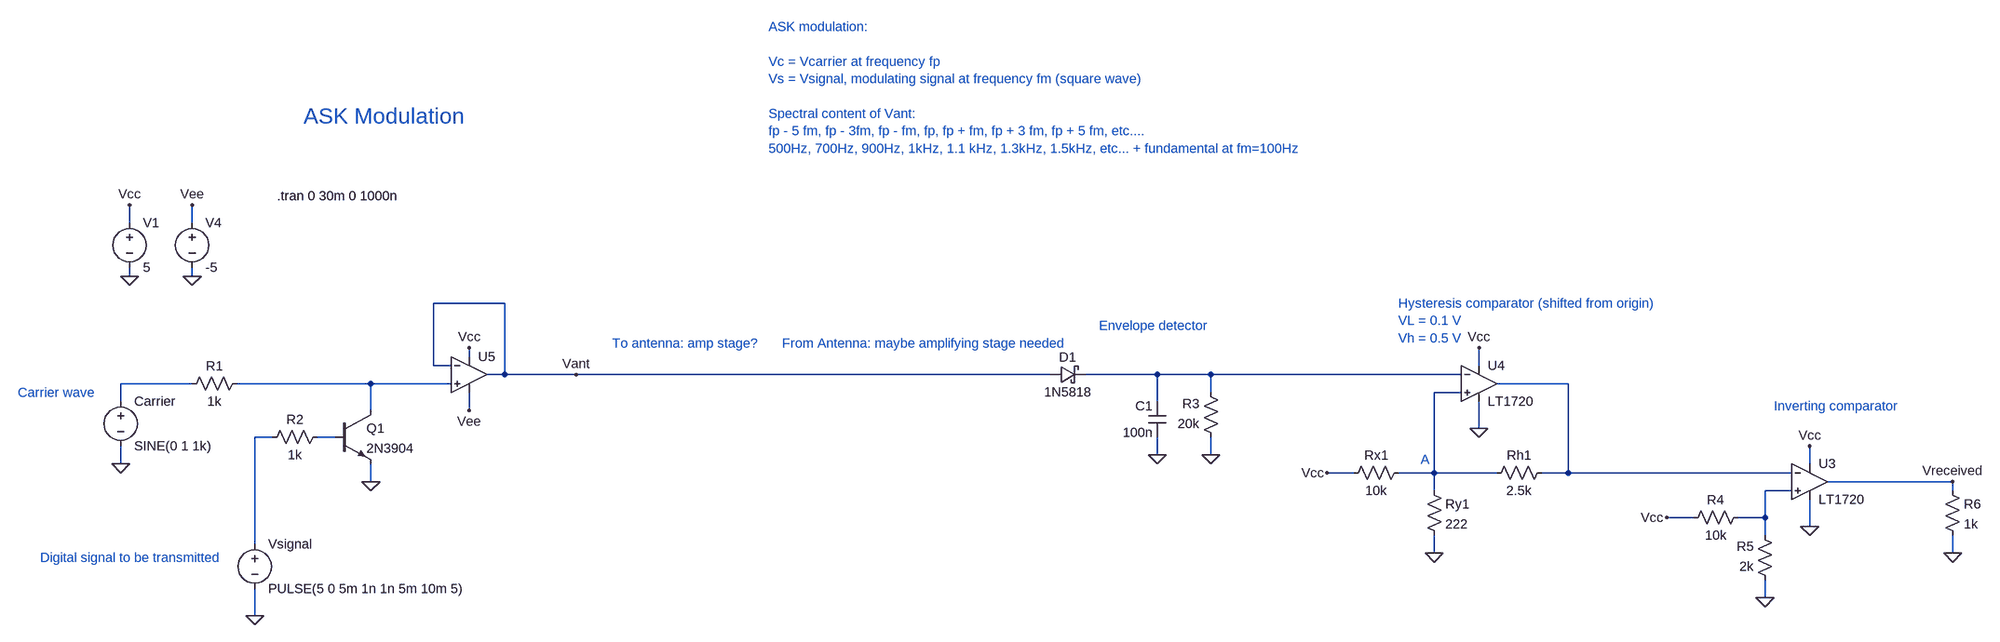
[diagram p0: schematic ASK-modulation.asc]
ASK-modulation.asc, the LTspice schematic file:
Version 4.1
SHEET 1 3624 680
WIRE -656 -80 -656 -112
WIRE -544 -80 -544 -112
WIRE -656 16 -656 0
WIRE -544 16 -544 0
WIRE 16 64 -112 64
WIRE -48 160 -48 144
WIRE -112 176 -112 64
WIRE -80 176 -112 176
WIRE 1760 176 1760 144
WIRE 16 192 16 64
WIRE 16 192 -16 192
WIRE 144 192 16 192
WIRE 992 192 144 192
WIRE 1184 192 1056 192
WIRE 1280 192 1184 192
WIRE 1728 192 1280 192
WIRE -544 208 -672 208
WIRE -224 208 -464 208
WIRE -80 208 -224 208
WIRE 1920 208 1792 208
WIRE 1280 224 1280 192
WIRE 1728 224 1680 224
WIRE -672 240 -672 208
WIRE 1184 240 1184 192
WIRE -224 256 -224 208
WIRE -48 256 -48 224
WIRE 1760 288 1760 240
WIRE -400 304 -432 304
WIRE -288 304 -320 304
WIRE 1184 336 1184 304
WIRE 1280 336 1280 304
WIRE -672 352 -672 320
WIRE 2352 352 2352 320
WIRE 1536 368 1488 368
WIRE 1680 368 1680 224
WIRE 1680 368 1616 368
WIRE 1792 368 1680 368
WIRE 1920 368 1920 208
WIRE 1920 368 1872 368
WIRE 2320 368 1920 368
WIRE -224 384 -224 352
WIRE 2608 384 2384 384
WIRE 1680 400 1680 368
WIRE 2320 400 2272 400
WIRE 2608 400 2608 384
WIRE 2144 448 2096 448
WIRE 2272 448 2272 400
WIRE 2272 448 2224 448
WIRE 2352 464 2352 416
WIRE 2272 480 2272 448
WIRE -432 496 -432 304
WIRE 1680 512 1680 480
WIRE 2608 512 2608 480
WIRE 2272 592 2272 560
WIRE -432 624 -432 576
FLAG -432 624 0
FLAG -672 352 0
FLAG -224 384 0
FLAG -656 16 0
FLAG -656 -112 Vcc
FLAG -544 16 0
FLAG -544 -112 Vee
FLAG 1280 336 0
FLAG 1760 144 Vcc
FLAG 1680 512 0
FLAG 1760 288 0
FLAG 1488 368 Vcc
FLAG 2352 320 Vcc
FLAG 2352 464 0
FLAG 2272 592 0
FLAG 2096 448 Vcc
FLAG 2608 512 0
FLAG -48 144 Vcc
FLAG -48 256 Vee
FLAG 1184 336 0
FLAG 2608 384 Vreceived
FLAG 144 192 Vant
SYMBOL voltage -656 -96 R0
WINDOW 123 0 0 Left 0
WINDOW 39 0 0 Left 0
SYMATTR InstName V1
SYMATTR Value 5
SYMBOL voltage -672 224 R0
WINDOW 123 0 0 Left 0
WINDOW 39 0 0 Left 0
SYMATTR InstName Carrier
SYMATTR Value SINE(0 1 1k)
SYMBOL res -448 192 R90
WINDOW 0 0 56 VBottom 2
WINDOW 3 32 56 VTop 2
SYMATTR InstName R1
SYMATTR Value 1k
SYMBOL npn -288 256 R0
SYMATTR InstName Q1
SYMATTR Value 2N3904
SYMBOL voltage -432 480 R0
WINDOW 123 0 0 Left 0
WINDOW 39 0 0 Left 0
SYMATTR InstName Vsignal
SYMATTR Value PULSE(5 0 5m 1n 1n 5m 10m 5)
SYMBOL voltage -544 -96 R0
WINDOW 123 0 0 Left 0
WINDOW 39 0 0 Left 0
SYMATTR InstName V4
SYMATTR Value -5
SYMBOL res -304 288 R90
WINDOW 0 0 56 VBottom 2
WINDOW 3 32 56 VTop 2
SYMATTR InstName R2
SYMATTR Value 1k
SYMBOL res 1296 320 R180
WINDOW 0 36 76 Left 2
WINDOW 3 36 40 Left 2
SYMATTR InstName R3
SYMATTR Value 20k
SYMBOL cap 1200 304 R180
WINDOW 0 24 56 Left 2
WINDOW 3 24 8 Left 2
SYMATTR InstName C1
SYMATTR Value 100n
SYMBOL res 1632 352 R90
WINDOW 0 0 56 VBottom 2
WINDOW 3 32 56 VTop 2
SYMATTR InstName Rx1
SYMATTR Value 10k
SYMBOL res 1664 384 R0
SYMATTR InstName Ry1
SYMATTR Value 222
SYMBOL res 1888 352 R90
WINDOW 0 0 56 VBottom 2
WINDOW 3 32 56 VTop 2
SYMATTR InstName Rh1
SYMATTR Value 2.5k
SYMBOL Comparators\\LT1720 1760 144 R0
SYMATTR InstName U4
SYMBOL Comparators\\LT1720 2352 320 R0
SYMATTR InstName U3
SYMBOL res 2240 432 R90
WINDOW 0 0 56 VBottom 2
WINDOW 3 32 56 VTop 2
SYMATTR InstName R4
SYMATTR Value 10k
SYMBOL res 2288 576 R180
WINDOW 0 36 76 Left 2
WINDOW 3 36 40 Left 2
SYMATTR InstName R5
SYMATTR Value 2k
SYMBOL res 2592 384 R0
SYMATTR InstName R6
SYMATTR Value 1k
SYMBOL Opamps\\UniversalOpamp2 -48 192 R0
SYMATTR InstName U5
SYMBOL schottky 992 208 R270
WINDOW 0 32 32 VTop 2
WINDOW 3 0 32 VBottom 2
SYMATTR InstName D1
SYMATTR Value 1N5818
SYMATTR Description Diode
SYMATTR Type diode
TEXT -344 -272 Left 4 ;ASK Modulation
TEXT -392 -128 Left 2 !.tran 0 30m 0 1000n
TEXT 208 136 Left 2 ;To antenna: amp stage?
TEXT 1656 344 Left 2 ;A
TEXT -856 224 Left 2 ;Carrier wave
TEXT -816 520 Left 2 ;Digital signal to be transmitted
TEXT 512 136 Left 2 ;From Antenna: maybe amplifying stage needed
TEXT 1080 104 Left 2 ;Envelope detector
TEXT 1616 64 Left 2 ;Hysteresis comparator (shifted from origin)\nVL = 0.1 V\nVh = 0.5 V
TEXT 2288 248 Left 2 ;Inverting comparator
TEXT 488 -432 Left 2 ;ASK modulation:\n \nVc = Vcarrier at frequency fp\nVs = Vsignal, modulating signal at frequency fm (square wave)\n \nSpectral content of Vant:\nfp - 5 fm, fp - 3fm, fp - fm, fp, fp + fm, fp + 3 fm, fp + 5 fm, etc....\n500Hz, 700Hz, 900Hz, 1kHz, 1.1 kHz, 1.3kHz, 1.5kHz, etc... + fundamental at fm=100Hz

The netlist it stands for:
* ASK-modulation.asc
V1 Vcc 0 5
V§Carrier N002 0 SINE(0 1 1k)
R1 N003 N002 1k
Q1 N003 N007 0 0 2N3904
Vsignal N006 0 PULSE(5 0 5m 1n 1n 5m 10m 5)
V4 Vee 0 -5
R2 N007 N006 1k
R3 0 N001 20k
C1 0 N001 100n
Rx1 N005 Vcc 10k
Ry1 N005 0 222
Rh1 N004 N005 2.5k
X§U4 N005 N001 Vcc 0 N004 LT1720  ; pins In+ In- V+ V- OUT
X§U3 N008 N004 Vcc 0 Vreceived LT1720  ; pins In+ In- V+ V- OUT
R4 N008 Vcc 10k
R5 0 N008 2k
R6 Vreceived 0 1k
X§U5 N003 Vant Vcc Vee Vant level.2 Avol=1Meg GBW=10Meg Slew=10Meg ilimit=25m rail=0 Vos=0 phimargin=45 en=0 enk=0 in=0 ink=0 Rin=500Meg  ; pins IN+ IN- V+ V- OUT
D1 Vant N001 1N5818
.model D D
.lib standard.dio
.model NPN NPN
.model PNP PNP
.lib standard.bjt
* ASK Modulation
.tran 0 30m 0 1000n
* To antenna: amp stage?
* A
* Carrier wave
* Digital signal to be transmitted
* From Antenna: maybe amplifying stage needed
* Envelope detector
* Hysteresis comparator (shifted from origin)
* VL = 0.1 V
* Vh = 0.5 V
* Inverting comparator
* ASK modulation:
* Vc = Vcarrier at frequency fp
* Vs = Vsignal, modulating signal at frequency fm (square wave)
* Spectral content of Vant:
* fp - 5 fm, fp - 3fm, fp - fm, fp, fp + fm, fp + 3 fm, fp + 5 fm, etc....
* 500Hz, 700Hz, 900Hz, 1kHz, 1.1 kHz, 1.3kHz, 1.5kHz, etc... + fundamental at fm=100Hz
.lib LT1720.sub
.lib UniversalOpamps2.sub
.backanno
.end